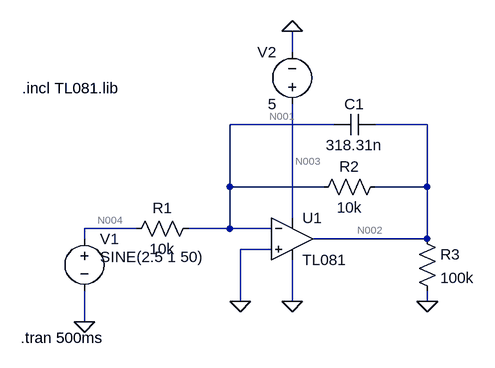
[diagram p0: schematic Draft3.asc]
Draft3.asc, the LTspice schematic file:
Version 4
SHEET 1 880 680
WIRE 224 -80 224 -112
WIRE 288 32 128 32
WIRE 432 32 352 32
WIRE 128 128 128 32
WIRE 272 128 128 128
WIRE 432 128 432 32
WIRE 432 128 352 128
WIRE 224 176 224 0
WIRE -16 192 -96 192
WIRE 128 192 128 128
WIRE 128 192 64 192
WIRE 192 192 128 192
WIRE -96 208 -96 192
WIRE 432 208 432 128
WIRE 432 208 256 208
WIRE 192 224 144 224
WIRE 144 304 144 224
WIRE 224 304 224 240
WIRE 432 304 432 288
WIRE -96 336 -96 288
FLAG 224 304 0
FLAG 432 304 0
FLAG 144 304 0
FLAG -96 336 0
FLAG 224 -112 0
SYMBOL Opamps\\opamp2 224 144 R0
SYMATTR InstName U1
SYMATTR Value TL081
SYMBOL res 80 176 R90
WINDOW 0 0 56 VBottom 2
WINDOW 3 32 56 VTop 2
SYMATTR InstName R1
SYMATTR Value 10k
SYMBOL res 368 112 R90
WINDOW 0 0 56 VBottom 2
WINDOW 3 32 56 VTop 2
SYMATTR InstName R2
SYMATTR Value 10k
SYMBOL cap 352 16 R90
WINDOW 0 0 32 VBottom 2
WINDOW 3 32 32 VTop 2
SYMATTR InstName C1
SYMATTR Value 318.31n
SYMBOL res 416 192 R0
SYMATTR InstName R3
SYMATTR Value 100k
SYMBOL voltage -96 192 R0
WINDOW 3 24 44 Left 2
WINDOW 123 24 72 Left 2
WINDOW 39 0 0 Left 0
SYMATTR InstName V1
SYMATTR Value SINE(2.5 1 50)
SYMBOL voltage 224 16 R180
WINDOW 0 24 96 Left 2
WINDOW 3 24 16 Left 2
WINDOW 123 0 0 Left 0
WINDOW 39 0 0 Left 0
SYMATTR InstName V2
SYMATTR Value 5
TEXT -192 -24 Left 2 !.incl TL081.lib
TEXT -194 360 Left 2 !.tran 500ms

The netlist it stands for:
* Draft3.asc
XU1 0 N001 N003 0 N002 TL081  ; pins In+ In- V+ V- OUT
R1 N001 N004 10k
R2 N002 N001 10k
C1 N002 N001 318.31n
R3 N002 0 100k
V1 N004 0 SINE(2.5 1 50)
V2 N003 0 5
.incl TL081.lib
.tran 500ms
.backanno
.end

* Results of the author's LTspice run, read from the files saved beside the schematic
* Operating Point, zero values left out:
*   V(n002) = 1.545 V
*   V(n003) = 5 V
*   V(n001) = 2.023 V
*   V(n004) = 2.5 V
*   I(R3) = 15.45 µA
*   I(R2) = -47.73 µA
*   I(R1) = -47.73 µA
*   I(V2) = -2.528 mA
*   I(V1) = -47.73 µA
*   Ix(u1:1) = -113.9 µA
*   Ix(u1:2) = 33.64 pA
*   Ix(u1:3) = 2.528 mA
*   Ix(u1:4) = -2.338 mA
*   Ix(u1:5) = 32.27 µA
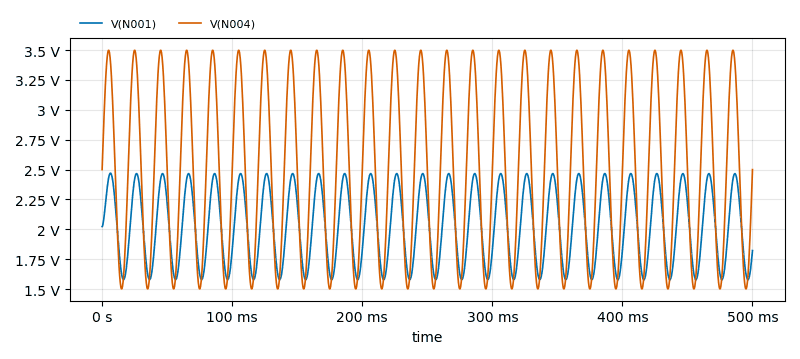
[diagram p1: Transient Analysis of Draft3.asc, plotted from the saved traces]
* Transient Analysis, 1 run:
*   V(N001): min 1.579 V, max 2.47 V, average 2.023 V, rms 2.048 V, last 1.822 V
*   V(N004): min 1.502 V, max 3.498 V, average 2.5 V, rms 2.598 V, last 2.5 V